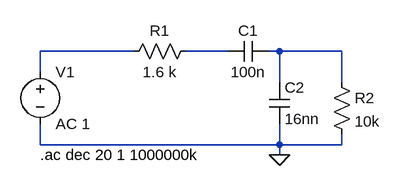
[diagram p0: schematic Band Pass Filter.asc]
Band Pass Filter.asc, the LTspice schematic file:
Version 4
SHEET 1 880 680
WIRE 96 96 -48 96
WIRE 240 96 176 96
WIRE 320 96 304 96
WIRE 416 96 320 96
WIRE -48 128 -48 96
WIRE 320 144 320 96
WIRE 416 144 416 96
WIRE -48 240 -48 208
WIRE 320 240 320 208
WIRE 320 240 -48 240
WIRE 416 240 416 224
WIRE 416 240 320 240
WIRE 320 256 320 240
FLAG 320 256 0
SYMBOL voltage -48 112 R0
SYMATTR InstName V1
SYMATTR Value AC 1
SYMBOL cap 304 80 R90
WINDOW 0 0 32 VBottom 2
WINDOW 3 32 32 VTop 2
SYMATTR InstName C1
SYMATTR Value 100n
SYMBOL res 192 80 R90
WINDOW 0 0 56 VBottom 2
WINDOW 3 32 56 VTop 2
SYMATTR InstName R1
SYMATTR Value 1.6 k
SYMBOL cap 304 144 R0
SYMATTR InstName C2
SYMATTR Value 16nn
SYMBOL res 400 128 R0
SYMATTR InstName R2
SYMATTR Value 10k
TEXT -48 256 Left 2 !.ac dec 20 1 1000000k

The netlist it stands for:
* Band Pass Filter.asc
V1 N001 0 AC 1
C1 N003 N002 100n
R1 N002 N001 1.6 k
C2 N003 0 16nn
R2 N003 0 10k
.ac dec 20 1 1000000k
.backanno
.end